# Altium project Alt_BRD_LM317_LM337.PrjPcb
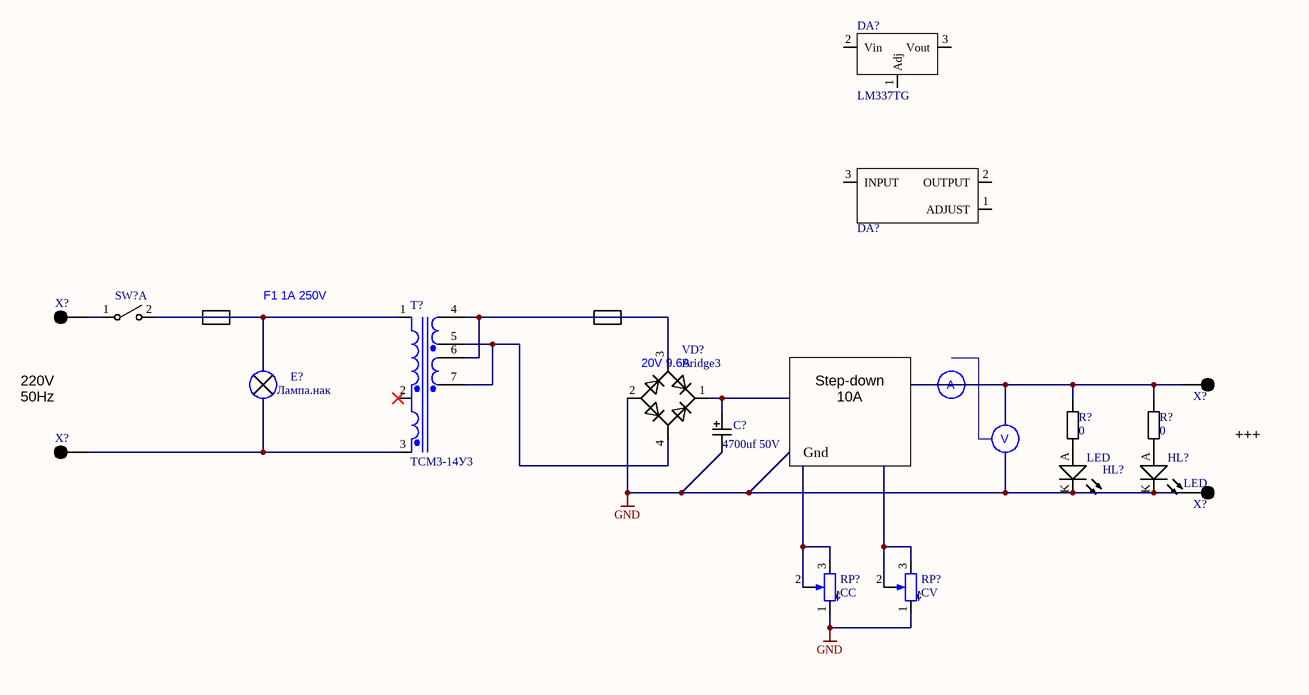
[diagram p0: Alt_BRD_LM317_LM337.SchDoc]
1 sheet, 17 parts. Net scope: global (net labels, ports and power ports of the same name join across sheets).
Board file: Alt_BRD_LM317_LM337.PcbDoc

## Sheet Alt_BRD_LM317_LM337.SchDoc
size A3; SheetNumber: 1; SheetTotal: 1

### Parts
(Parts that share a designator on the sheet are numbered #1, #2 ... from top to bottom, then left to right.)
C?  4700uf 50V  [CAPMP3528X210N]
DA?#1  LM337TG  [TO-220AB]
DA?#2  1.5A +1,2- +37V  [TO-220AB]  (value not drawn)
E?  Лампа.нак
HL?#1  LED  [LED 5mm Green]
HL?#2  LED  [LED 5mm Green]
R?#1  0  [REZKemet 0402]
R?#2  0  [REZKemet 0402]
RP?#1  CC  [POT16K1-LIN]
RP?#2  CV  [POT16K1-LIN]
SW?  219-12MST  [219-12MST]  (value not drawn)  (part A of 12)
T?  ТСМ3-14У3
VD?  Bridge3  [DF206ST-G]
X?#1  X1-PLS-1  [HoleSolderPLS-1]  (value not drawn)
X?#2  X1-PLS-1  [HoleSolderPLS-1]  (value not drawn)
X?#3  X1-PLS-1  [HoleSolderPLS-1]  (value not drawn)
X?#4  X1-PLS-1  [HoleSolderPLS-1]  (value not drawn)

### Nets
GND: C?.2 HL?#1.K HL?#2.K RP?#1.1(TOP) RP?#2.1(TOP) VD?.2(A) X?#4.1
NetC?_1: C?.1 VD?.1(C)
NetHL?#1_A: HL?#1.A R?#1.1
NetHL?#2_A: HL?#2.A R?#2.1
NetR?#1_2: R?#1.2 R?#2.2 X?#2.1
NetRP?#1_2: RP?#1.2(BOT) RP?#1.3(TAP)
NetRP?#2_2: RP?#2.2(BOT) RP?#2.3(TAP)
NetSW?_1: SW?.1 X?#1.1
NetSW?_2: SW?.2 T?.1(Pri2-)
NetT?_3: T?.3(Pri1+) X?#3.1
NetT?_4: T?.4(Sec2-) T?.6(Sec2-) VD?.3(C)
NetT?_5: T?.5(Sec2+) T?.7(Sec2+) VD?.4(C)

Not connected (* = marked no-connect by the designer): DA?#1 1(Adj) 2(Vin) 3(Vout); DA?#2 1(ADJUST) 2(OUTPUT) 3(INPUT); T? 2(Pri2+)*

### Notes on the sheet
- F1 1A 250V
- (near VD?) 20V 9.6A
- A
- (near X?#3) 220V
  50Hz
- Step-down 10A
- Gnd
- V
- (near X?#4) +++

### Library data of the parts
C? = CapTantB: ?; Manufacturer Part Number: TAJB107M010RNJ; Part Number: CapTantB; HelpURL: https://www.digikey.com/product-detail/en/avx-corporation/TAJB107M010RNJ/478-5801-1-ND/2136392; Digi-Key Part Number: 478-5801-1-ND; Price$: 0.71; Note: ?; Code_JEDEC: 1411 B
DA?#1 = LM337TG: Linear Voltage Regulator IC  1 Output  1.5A TO-220AB; Part Number: LM337TG; HelpURL: https://www.digikey.com/en/products/detail/on-semiconductor/LM337TG/918515?s=N4IgTCBcDaIDIFkDMSDsAVA4iAugXyA; Price$: 0.29029; Digi-Key Part Number: LM337TGOS-ND; Manufacturer Part Number: LM337TG; Package: TO-220AB
DA?#2 = LM317T: IC REG LIN POS ADJ 1.5A TO220AB; Part Number: LM317T; HelpURL: https://www.digikey.com/en/products/detail/stmicroelectronics/LM317T/591677; Price$: 0.21381; Digi-Key Part Number: 497-1575-5-ND; Manufacturer Part Number: LM317T; Package: TO-220AB
HL?#1 HL?#2 = FYL-5013 GD: ?; Part Number: FYL-5013 GD; Digi-Key Part Number: ?; Price$: ?; Note: ?; Manufacturer Part Number: ?; Code_JEDEC: ?
R?#1 R?#2 = RESC1005(0402): Note: ???; Part Number: RESC1005(0402); HelpURL: ???; Digi-Key Part Number: ???; Price$: ???; Manufacturer Part Number: ???; Code_JEDEC: ???
RP?#1 RP?#2 = 50k POT16K1-LIN: Note: ???; Part Number: 50k POT16K1-LIN; HelpURL: ???; Digi-Key Part Number: ???; Price$: ???; Manufacturer Part Number: ???; Code_JEDEC: ???
SW? = 219-12MST: SWITCH SLIDE DIP SPST 100MA 20V; Note: ???; Part Number: 219-12MST; HelpURL: https://www.digikey.com/product-detail/en/cts-electrocomponents/219-12MST/CT21912MST-ND/223218; Digi-Key Part Number: CT21912MST-ND; Price$: 1.38; Manufacturer Part Number: 219-12MST; Code_JEDEC: ???
VD? = DF10S-E3/77: Miniature Glass Passivated Single-Phase / Surface Mount Bridge Rectifiers; Part Number: DF10S-E3/77; HelpURL: https://ru.mouser.com/datasheet/2/427/dfs-240405.pdf; Price$: ?; Note: ?; Manufacturer Part Number: ?; Code_JEDEC: ?
X?#1-X?#4 = X1-PLS-1: контакт под пайку; Part Number: X1-PLS-1
E? = Лампа.нак: Part Number: Лампа.нак
T? = ТСМ3-14У3: Part Number: ТСМ3-14У3